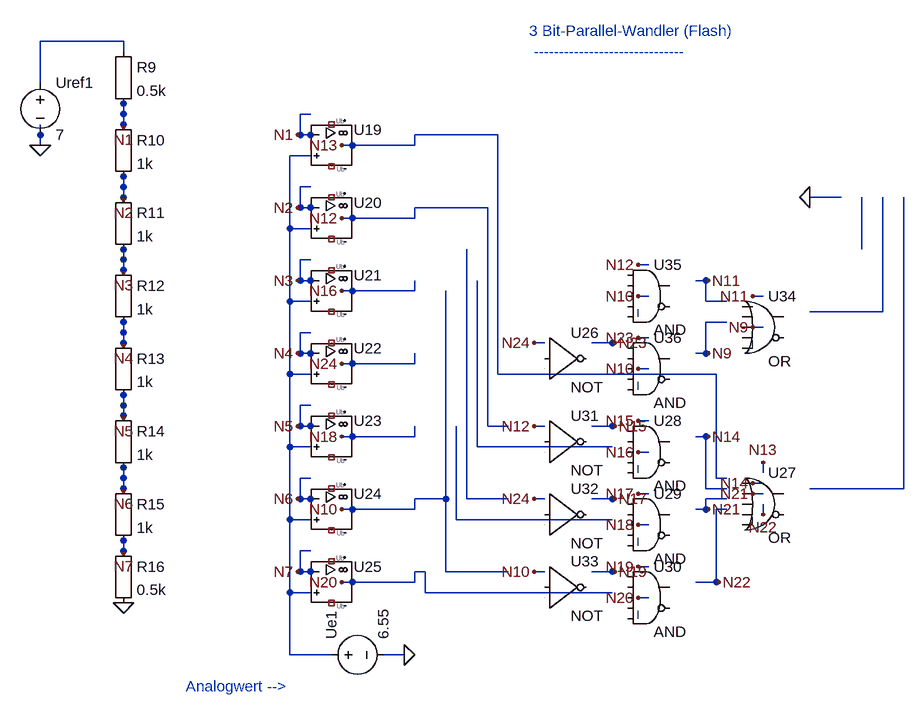
[diagram p0: schematic 8_2_2_Parallel_Wandler_Flash.asc]
8_2_2_Parallel_Wandler_Flash.asc, the LTspice schematic file:
Version 4
SHEET 1 880 680
WIRE 512 208 496 208
WIRE 496 208 496 176
WIRE 496 176 512 176
WIRE 576 224 672 224
WIRE 672 224 672 208
WIRE 512 320 496 320
WIRE 496 320 496 288
WIRE 496 288 512 288
WIRE 576 336 672 336
WIRE 672 336 672 320
WIRE 512 432 496 432
WIRE 496 432 496 400
WIRE 496 400 512 400
WIRE 576 448 672 448
WIRE 672 448 672 432
WIRE 512 544 496 544
WIRE 496 544 496 512
WIRE 496 512 512 512
WIRE 576 560 672 560
WIRE 672 560 672 544
WIRE 512 656 496 656
WIRE 496 656 496 624
WIRE 496 624 512 624
WIRE 576 672 672 672
WIRE 672 672 672 656
WIRE 512 768 496 768
WIRE 496 768 496 736
WIRE 496 736 512 736
WIRE 576 784 672 784
WIRE 672 784 672 768
WIRE 512 880 496 880
WIRE 496 880 496 848
WIRE 496 848 512 848
WIRE 576 896 672 896
WIRE 672 896 672 880
WIRE 624 1008 640 1008
WIRE 96 208 96 192
WIRE 224 160 224 176
WIRE 224 272 224 288
WIRE 224 384 224 400
WIRE 224 608 224 624
WIRE 224 720 224 736
WIRE 224 832 224 848
WIRE 640 1008 656 1008
WIRE 96 192 96 224
WIRE 224 176 224 192
WIRE 224 288 224 304
WIRE 224 400 224 416
WIRE 224 496 224 512
WIRE 224 512 224 528
WIRE 224 624 224 640
WIRE 224 736 224 752
WIRE 512 240 480 240
WIRE 480 240 480 352
WIRE 480 352 480 464
WIRE 512 352 480 352
WIRE 480 464 480 576
WIRE 512 464 480 464
WIRE 480 576 480 688
WIRE 512 576 480 576
WIRE 480 688 480 800
WIRE 512 688 480 688
WIRE 480 800 480 912
WIRE 512 800 480 800
WIRE 480 912 480 1008
WIRE 480 1008 544 1008
WIRE 512 912 480 912
WIRE 224 80 224 64
WIRE 224 64 96 64
WIRE 96 64 96 128
WIRE 672 208 800 208
WIRE 800 208 800 576
WIRE 800 576 1136 576
WIRE 1136 576 1136 736
WIRE 1136 736 1152 736
WIRE 1104 672 1120 672
WIRE 1120 672 1120 752
WIRE 1120 752 1152 752
WIRE 944 656 976 656
WIRE 976 768 944 768
WIRE 816 768 752 768
WIRE 752 768 752 544
WIRE 752 544 752 528
WIRE 976 880 944 880
WIRE 976 912 688 912
WIRE 688 912 688 880
WIRE 688 880 672 880
WIRE 1152 768 1120 768
WIRE 1120 768 1120 784
WIRE 1120 784 1104 784
WIRE 1152 784 1136 784
WIRE 1136 784 1136 896
WIRE 1136 896 1104 896
WIRE 768 432 768 688
WIRE 768 688 976 688
WIRE 672 768 720 768
WIRE 1152 496 1120 496
WIRE 1120 496 1120 544
WIRE 1120 544 1104 544
WIRE 1104 432 1120 432
WIRE 1120 432 1120 464
WIRE 1120 464 1152 464
WIRE 944 528 976 528
WIRE 720 448 720 560
WIRE 816 656 784 656
WIRE 784 656 784 416
WIRE 720 768 720 880
WIRE 720 880 816 880
WIRE 720 560 720 768
WIRE 976 800 736 800
WIRE 736 800 736 656
WIRE 784 416 784 320
WIRE 784 320 672 320
WIRE 1424 304 1424 752
WIRE 1424 752 1280 752
WIRE 1392 304 1392 480
WIRE 1392 480 1280 480
WIRE 1360 304 1360 384
WIRE 752 384 752 528
WIRE 1280 304 1328 304
WIRE 224 160 224 196
WIRE 512 208 492 208
WIRE 224 272 224 308
WIRE 512 320 492 320
WIRE 224 384 224 420
WIRE 512 432 492 432
WIRE 224 496 224 532
WIRE 512 544 492 544
WIRE 224 608 224 644
WIRE 512 656 492 656
WIRE 224 720 224 756
WIRE 512 768 492 768
WIRE 224 832 224 852
WIRE 512 880 492 880
WIRE 1032 568 1016 568
WIRE 1032 456 1016 456
WIRE 872 880 856 880
WIRE 576 784 560 784
WIRE 872 656 856 656
WIRE 1032 408 1016 408
WIRE 576 336 560 336
WIRE 576 224 560 224
WIRE 1208 728 1208 712
WIRE 1104 672 1124 672
WIRE 1208 744 1192 744
WIRE 944 656 980 656
WIRE 1032 648 1016 648
WIRE 1032 760 1016 760
WIRE 944 768 980 768
WIRE 1032 872 1016 872
WIRE 944 880 980 880
WIRE 1032 920 1016 920
WIRE 576 896 560 896
WIRE 1208 760 1192 760
WIRE 1104 784 1124 784
WIRE 1208 776 1208 792
WIRE 1104 896 1140 896
WIRE 576 448 560 448
WIRE 1032 696 1016 696
WIRE 1208 504 1192 504
WIRE 1104 544 1124 544
WIRE 1104 432 1124 432
WIRE 1208 456 1192 456
WIRE 944 528 980 528
WIRE 1032 520 1016 520
WIRE 1032 808 1016 808
WIRE 576 672 560 672
WIRE 576 560 560 560
WIRE 872 768 856 768
WIRE 872 528 856 528
FLAG 224 928 0
FLAG 656 1008 0
FLAG 96 224 0
FLAG 1280 304 0
FLAG 224 196 N1
FLAG 492 208 N1
FLAG 224 308 N2
FLAG 492 320 N2
FLAG 224 420 N3
FLAG 492 432 N3
FLAG 224 532 N4
FLAG 492 544 N4
FLAG 224 644 N5
FLAG 492 656 N5
FLAG 224 756 N6
FLAG 492 768 N6
FLAG 224 852 N7
FLAG 492 880 N7
FLAG 224 928 0
FLAG 656 1008 0
FLAG 96 224 0
FLAG 1280 304 0
FLAG 1016 568 N10
FLAG 1016 456 N10
FLAG 856 880 N10
FLAG 560 784 N10
FLAG 856 656 N12
FLAG 1016 408 N12
FLAG 560 336 N12
FLAG 560 224 N13
FLAG 1208 712 N13
FLAG 1124 672 N14
FLAG 1192 744 N14
FLAG 980 656 N15
FLAG 1016 648 N15
FLAG 1016 760 N17
FLAG 980 768 N17
FLAG 1016 872 N19
FLAG 980 880 N19
FLAG 1016 920 N20
FLAG 560 896 N20
FLAG 1192 760 N21
FLAG 1124 784 N21
FLAG 1208 792 N22
FLAG 1140 896 N22
FLAG 560 448 N16
FLAG 1016 696 N16
FLAG 1192 504 N9
FLAG 1124 544 N9
FLAG 1124 432 N11
FLAG 1192 456 N11
FLAG 980 528 N23
FLAG 1016 520 N23
FLAG 1016 808 N18
FLAG 560 672 N18
FLAG 560 560 N24
FLAG 856 768 N24
FLAG 856 528 N24
SYMBOL Misc\EuropeanResistor 208 64 R0
SYMATTR InstName R9
SYMATTR Value 0.5k
SYMBOL Misc\EuropeanResistor 208 176 R0
SYMATTR InstName R10
SYMATTR Value 1k
SYMBOL UniversalOpAmp2 544 224 R0
SYMATTR InstName U19
SYMATTR Value UniversalOpAmp2
SYMBOL Misc\EuropeanResistor 208 288 R0
SYMATTR InstName R11
SYMATTR Value 1k
SYMBOL UniversalOpAmp2 544 336 R0
SYMATTR InstName U20
SYMATTR Value UniversalOpAmp2
SYMBOL Misc\EuropeanResistor 208 400 R0
SYMATTR InstName R12
SYMATTR Value 1k
SYMBOL UniversalOpAmp2 544 448 R0
SYMATTR InstName U21
SYMATTR Value UniversalOpAmp2
SYMBOL Misc\EuropeanResistor 208 512 R0
SYMATTR InstName R13
SYMATTR Value 1k
SYMBOL UniversalOpAmp2 544 560 R0
SYMATTR InstName U22
SYMATTR Value UniversalOpAmp2
SYMBOL Misc\EuropeanResistor 208 624 R0
SYMATTR InstName R14
SYMATTR Value 1k
SYMBOL UniversalOpAmp2 544 672 R0
SYMATTR InstName U23
SYMATTR Value UniversalOpAmp2
SYMBOL Misc\EuropeanResistor 208 736 R0
SYMATTR InstName R15
SYMATTR Value 1k
SYMBOL UniversalOpAmp2 544 784 R0
SYMATTR InstName U24
SYMATTR Value UniversalOpAmp2
SYMBOL Misc\EuropeanResistor 208 832 R0
SYMATTR InstName R16
SYMATTR Value 0.5k
SYMBOL UniversalOpAmp2 544 896 R0
SYMATTR InstName U25
SYMATTR Value UniversalOpAmp2
SYMBOL voltage 528 1008 R270
SYMATTR InstName Ue1
SYMATTR Value 6.55
SYMBOL voltage 96 112 R0
SYMATTR InstName Uref1
SYMATTR Value 7
SYMBOL Digital\inv 872 488 R0
SYMATTR InstName U26
SYMATTR Value NOT
SYMATTR LibreSpice gate=not;inputs=1;vth=2.5;vhigh=5;pins=In1,Out
SYMBOL Digital\or 1208 712 R0
SYMATTR InstName U27
SYMATTR Value OR
SYMATTR LibreSpice gate=or;inputs=4;vth=2.5;vhigh=5;pins=In1,In2,In3,In4,Out
SYMBOL Digital\and 1032 632 R0
SYMATTR InstName U28
SYMATTR Value AND
SYMATTR LibreSpice gate=and;inputs=2;vth=2.5;vhigh=5;pins=In1,In2,Out
SYMBOL Digital\and 1032 744 R0
SYMATTR InstName U29
SYMATTR Value AND
SYMATTR LibreSpice gate=and;inputs=2;vth=2.5;vhigh=5;pins=In1,In2,Out
SYMBOL Digital\and 1032 856 R0
SYMATTR InstName U30
SYMATTR Value AND
SYMATTR LibreSpice gate=and;inputs=2;vth=2.5;vhigh=5;pins=In1,In2,Out
SYMBOL Digital\inv 872 616 R0
SYMATTR InstName U31
SYMATTR Value NOT
SYMATTR LibreSpice gate=not;inputs=1;vth=2.5;vhigh=5;pins=In1,Out
SYMBOL Digital\inv 872 728 R0
SYMATTR InstName U32
SYMATTR Value NOT
SYMATTR LibreSpice gate=not;inputs=1;vth=2.5;vhigh=5;pins=In1,Out
SYMBOL Digital\inv 872 840 R0
SYMATTR InstName U33
SYMATTR Value NOT
SYMATTR LibreSpice gate=not;inputs=1;vth=2.5;vhigh=5;pins=In1,Out
SYMBOL Digital\or 1208 440 R0
SYMATTR InstName U34
SYMATTR Value OR
SYMATTR LibreSpice gate=or;inputs=2;vth=2.5;vhigh=5;pins=In1,In2,Out
SYMBOL Digital\and 1032 392 R0
SYMATTR InstName U35
SYMATTR Value AND
SYMATTR LibreSpice gate=and;inputs=2;vth=2.5;vhigh=5;pins=In1,In2,Out
SYMBOL Digital\and 1032 504 R0
SYMATTR InstName U36
SYMATTR Value AND
SYMATTR LibreSpice gate=and;inputs=2;vth=2.5;vhigh=5;pins=In1,In2,Out
TEXT 848 48 Left 2 ;3 Bit-Parallel-Wandler (Flash) \n ------------------------------
TEXT 320 1056 Left 2 ;Analogwert -->

The netlist it stands for:
* 8_2_2_Parallel_Wandler_Flash.asc
R9 N002 N1 0.5k
R10 N1 N2 1k
XU19 N001 N1 NC_01 NC_02 N13 level2 UniversalOpAmp2 Avol=1Meg GBW=10Meg Slew=10Meg Ilimit=25m Rail=0 Vos=0 En=0 Enk=0 In=0 Ink=0 Rin=500Meg  ; pins In+ In- V+ V- OUT
R11 N2 N3 1k
XU20 N001 N2 NC_03 NC_04 N12 level2 UniversalOpAmp2 Avol=1Meg GBW=10Meg Slew=10Meg Ilimit=25m Rail=0 Vos=0 En=0 Enk=0 In=0 Ink=0 Rin=500Meg  ; pins In+ In- V+ V- OUT
R12 N3 N4 1k
XU21 N001 N3 NC_05 NC_06 N16 level2 UniversalOpAmp2 Avol=1Meg GBW=10Meg Slew=10Meg Ilimit=25m Rail=0 Vos=0 En=0 Enk=0 In=0 Ink=0 Rin=500Meg  ; pins In+ In- V+ V- OUT
R13 N4 N5 1k
XU22 N001 N4 NC_07 NC_08 N24 level2 UniversalOpAmp2 Avol=1Meg GBW=10Meg Slew=10Meg Ilimit=25m Rail=0 Vos=0 En=0 Enk=0 In=0 Ink=0 Rin=500Meg  ; pins In+ In- V+ V- OUT
R14 N5 N6 1k
XU23 N001 N5 NC_09 NC_10 N18 level2 UniversalOpAmp2 Avol=1Meg GBW=10Meg Slew=10Meg Ilimit=25m Rail=0 Vos=0 En=0 Enk=0 In=0 Ink=0 Rin=500Meg  ; pins In+ In- V+ V- OUT
R15 N6 N7 1k
XU24 N001 N6 NC_11 NC_12 N10 level2 UniversalOpAmp2 Avol=1Meg GBW=10Meg Slew=10Meg Ilimit=25m Rail=0 Vos=0 En=0 Enk=0 In=0 Ink=0 Rin=500Meg  ; pins In+ In- V+ V- OUT
R16 N7 0 0.5k
XU25 N001 N7 NC_13 NC_14 N20 level2 UniversalOpAmp2 Avol=1Meg GBW=10Meg Slew=10Meg Ilimit=25m Rail=0 Vos=0 En=0 Enk=0 In=0 Ink=0 Rin=500Meg  ; pins In+ In- V+ V- OUT
V§Ue1 N001 0 6.55
V§Uref1 N002 0 7
A§U26 0 0 0 0 0 0 0 0 BUF NOT
A§U27 0 0 0 0 0 0 0 0 OR OR
A§U28 0 0 0 0 0 0 0 0 AND AND
A§U29 0 0 0 0 0 0 0 0 AND AND
A§U30 0 0 0 0 0 0 0 0 AND AND
A§U31 0 0 0 0 0 0 0 0 BUF NOT
A§U32 0 0 0 0 0 0 0 0 BUF NOT
A§U33 0 0 0 0 0 0 0 0 BUF NOT
A§U34 0 0 0 0 0 0 0 0 OR OR
A§U35 0 0 0 0 0 0 0 0 AND AND
A§U36 0 0 0 0 0 0 0 0 AND AND
* 3 Bit-Parallel-Wandler (Flash)
*  ------------------------------
* Analogwert -->
.lib UniversalOpAmp2.lib
.backanno
.end